# Altium schematic sheet Power_Management.SchDoc
size A4; DocumentNumber: 9; SheetNumber: 9; SheetTotal: 30
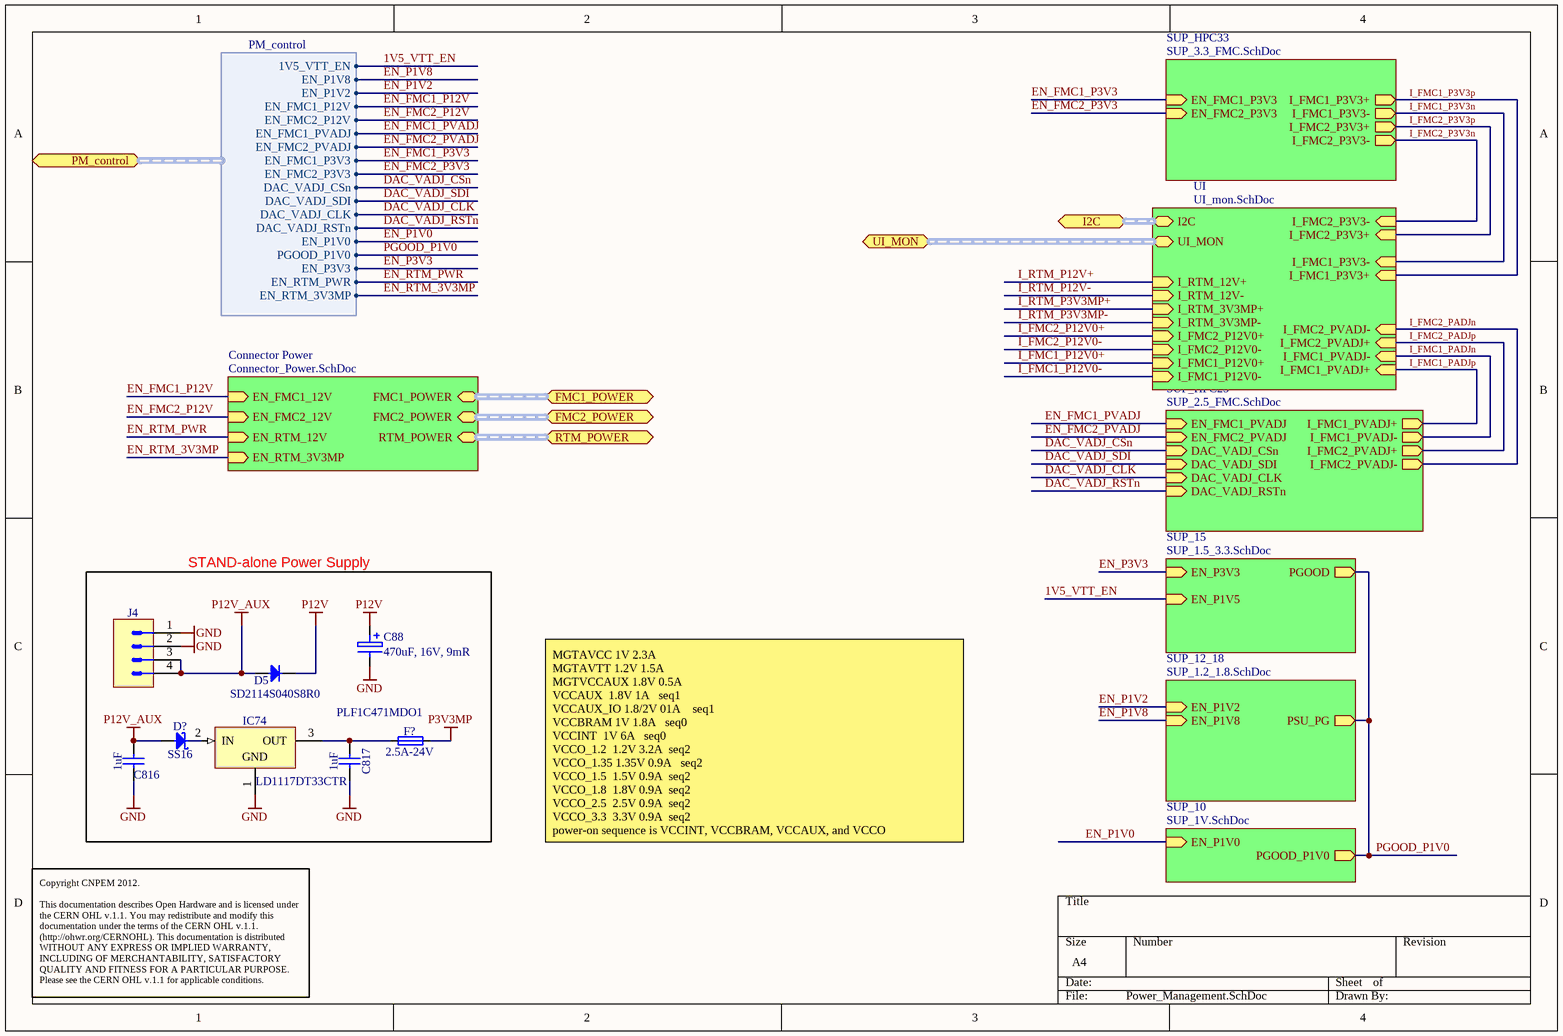
[diagram p0: Power_Management.SchDoc]

## Parts
C88  PLF1C471MDO1  value 470uF, 16V, 9mR  [CAPPR500-1000X1250]
C816  1uF  [CAPC1608X87N]
C817  1uF  [CAPC1608X87N]
D5  SD2114S040S8R0  [AVX_SMB (D0-214AA)]
D?  SS16  [DIOM5127X229N]
F?  2.5A-24V  [FUSC1608X55N]
IC74  LD1117DT33CTR  [TO228P972X240-3N-R540X510]
J4  Mini-Fit Jr.™  [MOLEX_39-28-1043]  (value not drawn)

## Blocks framed on the sheet
STAND-alone Power Supply: C88 C816 C817 D5 D? F? IC74 J4

## Sub-sheets
Connector Power = Connector_Power.SchDoc: FMC2_POWER (harness FMC_J1_POWER), EN_FMC1_12V (in), FMC1_POWER (harness FMC_J1_POWER), EN_FMC2_12V (in), EN_RTM_12V (in), RTM_POWER (harness RTM_POWER), EN_RTM_3V3MP (in)
SUP_10 = SUP_1V.SchDoc: PGOOD_P1V0 (out), EN_P1V0 (in)
SUP_12_18 = SUP_1.2_1.8.SchDoc: EN_P1V2 (in), EN_P1V8 (in), PSU_PG (out)
SUP_15 = SUP_1.5_3.3.SchDoc: PGOOD (out), EN_P1V5 (in), EN_P3V3 (in)
SUP_HPC25 = SUP_2.5_FMC.SchDoc: EN_FMC1_PVADJ (in), EN_FMC2_PVADJ (in), I_FMC1_PVADJ+ (out), I_FMC1_PVADJ- (out), I_FMC2_PVADJ+ (out), I_FMC2_PVADJ- (out), DAC_VADJ_CSn (in), DAC_VADJ_SDI (in), DAC_VADJ_CLK (in), DAC_VADJ_RSTn (in)
SUP_HPC33 = SUP_3.3_FMC.SchDoc: EN_FMC1_P3V3 (in), EN_FMC2_P3V3 (in), I_FMC1_P3V3+ (out), I_FMC1_P3V3- (out), I_FMC2_P3V3+ (out), I_FMC2_P3V3- (out)
UI = UI_mon.SchDoc: I_FMC2_P3V3- (in), I_FMC2_P3V3+ (in), I_FMC1_P3V3- (in), I_FMC1_P3V3+ (in), I_FMC1_PVADJ+ (in), I_FMC1_PVADJ- (in), I_FMC2_PVADJ+ (in), I_FMC2_PVADJ- (in), I_FMC2_P12V0+ (in), I_FMC2_P12V0- (in), I_FMC1_P12V0+ (in), I_FMC1_P12V0- (in), I2C (harness I2C), I_RTM_12V+ (in), I_RTM_12V- (in), I_RTM_3V3MP+ (in), I_RTM_3V3MP- (in), UI_MON (harness UI_MON)

## Ports
FMC1_POWER, FMC2_POWER, I2C (harness I2C), PM_control (harness PM_control), RTM_POWER, UI_MON

## Harnesses
PM_control: EN_P1V8, EN_P1V2, EN_FMC1_P12V, EN_FMC2_P12V, EN_FMC1_PVADJ, EN_FMC2_PVADJ, EN_FMC1_P3V3, EN_FMC2_P3V3, DAC_VADJ_CSn, DAC_VADJ_SDI, DAC_VADJ_CLK, DAC_VADJ_RSTn, 1V5_VTT_EN, EN_P1V0, PGOOD_P1V0, EN_P3V3, EN_RTM_PWR, EN_RTM_3V3MP

## Nets
GND: C88.2 C816.2 C817.2 IC74.1(GND) J4.1 J4.2
P3V3MP: F?.1
P12V: C88.1 D5.1(C)
P12V_AUX: C816.1 D5.2(A) D?.2(A) J4.3 J4.4
1V5_VTT_EN: sheet SUP_15/EN_P1V5, port PM_control.1V5_VTT_EN
DAC_VADJ_CLK: sheet SUP_HPC25/DAC_VADJ_CLK, port PM_control.DAC_VADJ_CLK
DAC_VADJ_CSn: sheet SUP_HPC25/DAC_VADJ_CSn, port PM_control.DAC_VADJ_CSn
DAC_VADJ_RSTn: sheet SUP_HPC25/DAC_VADJ_RSTn, port PM_control.DAC_VADJ_RSTn
DAC_VADJ_SDI: sheet SUP_HPC25/DAC_VADJ_SDI, port PM_control.DAC_VADJ_SDI
EN_FMC1_P3V3: sheet SUP_HPC33/EN_FMC1_P3V3, port PM_control.EN_FMC1_P3V3
EN_FMC1_P12V: sheet Connector Power/EN_FMC1_12V, port PM_control.EN_FMC1_P12V
EN_FMC1_PVADJ: sheet SUP_HPC25/EN_FMC1_PVADJ, port PM_control.EN_FMC1_PVADJ
EN_FMC2_P3V3: sheet SUP_HPC33/EN_FMC2_P3V3, port PM_control.EN_FMC2_P3V3
EN_FMC2_P12V: sheet Connector Power/EN_FMC2_12V, port PM_control.EN_FMC2_P12V
EN_FMC2_PVADJ: sheet SUP_HPC25/EN_FMC2_PVADJ, port PM_control.EN_FMC2_PVADJ
EN_P1V0: sheet SUP_10/EN_P1V0, port PM_control.EN_P1V0
EN_P1V2: sheet SUP_12_18/EN_P1V2, port PM_control.EN_P1V2
EN_P1V8: sheet SUP_12_18/EN_P1V8, port PM_control.EN_P1V8
EN_P3V3: sheet SUP_15/EN_P3V3, port PM_control.EN_P3V3
EN_RTM_3V3MP: sheet Connector Power/EN_RTM_3V3MP, port PM_control.EN_RTM_3V3MP
EN_RTM_PWR: sheet Connector Power/EN_RTM_12V, port PM_control.EN_RTM_PWR
I_FMC1_P3V3n: sheet SUP_HPC33/I_FMC1_P3V3-, sheet UI/I_FMC1_P3V3-
I_FMC1_P3V3p: sheet SUP_HPC33/I_FMC1_P3V3+, sheet UI/I_FMC1_P3V3+
I_FMC1_P12V0+: sheet UI/I_FMC1_P12V0+
I_FMC1_P12V0-: sheet UI/I_FMC1_P12V0-
I_FMC1_PADJn: sheet SUP_HPC25/I_FMC1_PVADJ-, sheet UI/I_FMC1_PVADJ-
I_FMC1_PADJp: sheet SUP_HPC25/I_FMC1_PVADJ+, sheet UI/I_FMC1_PVADJ+
I_FMC2_P3V3n: sheet SUP_HPC33/I_FMC2_P3V3-, sheet UI/I_FMC2_P3V3-
I_FMC2_P3V3p: sheet SUP_HPC33/I_FMC2_P3V3+, sheet UI/I_FMC2_P3V3+
I_FMC2_P12V0+: sheet UI/I_FMC2_P12V0+
I_FMC2_P12V0-: sheet UI/I_FMC2_P12V0-
I_FMC2_PADJn: sheet SUP_HPC25/I_FMC2_PVADJ-, sheet UI/I_FMC2_PVADJ-
I_FMC2_PADJp: sheet SUP_HPC25/I_FMC2_PVADJ+, sheet UI/I_FMC2_PVADJ+
I_RTM_P3V3MP+: sheet UI/I_RTM_3V3MP+
I_RTM_P3V3MP-: sheet UI/I_RTM_3V3MP-
I_RTM_P12V+: sheet UI/I_RTM_12V+
I_RTM_P12V-: sheet UI/I_RTM_12V-
PGOOD_P1V0: sheet SUP_15/PGOOD, sheet SUP_12_18/PSU_PG, sheet SUP_10/PGOOD_P1V0, port PM_control.PGOOD_P1V0
NetC817_1: C817.1 F?.2 IC74.3(OUT)
NetD?_1: D?.1(C) IC74.2(IN)

## Buses and harness runs
harness port FMC1_POWER = sheet Connector Power/FMC1_POWER
harness port FMC2_POWER = sheet Connector Power/FMC2_POWER
harness port I2C = sheet UI/I2C
harness port RTM_POWER = sheet Connector Power/RTM_POWER
harness port UI_MON = sheet UI/UI_MON

## Notes on the sheet
- MGTAVCC	1V	2.3A
  MGTAVTT	1.2V	1.5A
  MGTVCCAUX	1.8V	0.5A
  VCCAUX		1.8V	1A			seq1
  VCCAUX_IO	1.8/2V	01A 			seq1
  VCCBRAM	1V	1.8A			seq0
  VCCINT		1V	6A			seq0
  VCCO_1.2		1.2V	3.2A		seq2
  VCCO_1.35	1.35V	0.9A			seq2
  VCCO_1.5		1.5V	0.9A		seq2
  VCCO_1.8		1.8V	0.9A		seq2
  VCCO_2.5		2.5V	0.9A		seq2
  VCCO_3.3		3.3V	0.9A		seq2
  power-on sequence is VCCINT, VCCBRAM, VCCAUX, and VCCO
  voltage difference between VCCO and VCCAUX must not exceed 2.625V for longer than TVCCO2VCCAUX
  power-on sequence to achieve minimum current draw for the GTP transceivers is VCCINT, VMGTAVCC,
  VMGTAVTT OR VMGTAVCC, VCCINT, VMGTAVTT. There is no recommended sequencing for VMGTVCCAUX. Both VMGTAVCC and
  VCCINT can be ramped simultaneously. The recommended power-off sequence is the reverse of the power-on sequence to
  achieve minimum current draw.
  When VMGTAVTT is powered before VMGTAVCC and VMGTAVTT – VMGTAVCC > 150 mV and VMGTAVCC < 0.7V, the
  VMGTAVTT current draw can increase by 460 mA per transceiver during VMGTAVCC ramp up. The duration of the current
  draw can be up to 0.3 x TMGTAVCC (ramp time from GND to 90% of VMGTAVCC). The reverse is true for power-down.
  • When VMGTAVTT is powered before VCCINT and VMGTAVTT – VCCINT > 150 mV and VCCINT < 0.7V, the VMGTAVTT current
  draw can increase by 50 mA per transceiver during VCCINT ramp up. The duration of the current draw can be up to
  0.3 x TVCCINT (ramp time from GND to 90% of VCCINT). The reverse is true for power-down.
- Copyright CNPEM 2012.
  This documentation describes Open Hardware and is licensed under the CERN OHL v.1.1. You may redistribute and modify this documentation under the terms of the CERN OHL v.1.1. (http://ohwr.org/CERNOHL). This documentation is distributed WITHOUT ANY EXPRESS OR IMPLIED WARRANTY, INCLUDING OF MERCHANTABILITY, SATISFACTORY QUALITY AND FITNESS FOR A PARTICULAR PURPOSE. Please see the CERN OHL v.1.1 for applicable conditions.

## Library data of the parts
C88 = CAP_POLYMER_10mm: POLY, 470uF, 16V, ESR: 9mR
C816 C817 = CC0603_1UF_16V_10%_X7R: Non-polarised capacitor; Part Description: SMD Multilayer Chip Ceramic Capacitor; Manufacturer: GENERIC; Manufacturer1 Part Number: 223824613663; Voltage: 16V; TC: X7R; Tolerance: ±10%; Table: Capacitors SMD; Part Number: CC0603_1UF_16V_10%_X7R; Component Kind: Standard; Component Type: Standard; Pin Count: 2; Value: 1uF; Status: Preferred; Manufacturer Part Number: CC0603_1uF_16V_10%_X7R; Case: 0603; Mounted: Yes; Socket: No; SMD: Yes; Manufacturer1 Example: PHYCOMP; Manufacturer1 ComponentHeight: 0.87mm; HelpURL: \\cern.ch\dfs\Applications\Altium\Datasheets\CC0805_X5R_PHYCOMP_HC.pdf; Author: CERN DEM JLC; CreateDate: 2007-12-03; LatestRevisionDate: 2007-12-03
D5 = SD2114S040S8R0: Diode; Part Description: Schottky Barrier Rectifier Diode; Manufacturer: AVX; Voltage: 40V; Power: 8A; PressFit: No; Bonding: No; Part Number: SD2114S040S8R0; Component Kind: Standard; Component Type: Standard; Device: SD2114S040S8R0; PackageDescription: AVX SMB DO-214-AA Lead-less Chip Form, 2-Leads, Body 5.2x3.6mm; Manufacturer Part Number: SD2114S040S8R0; Pin Count: 2; Case: D0-214AA; Mounted: Yes; Socket: No; SMD: Yes; Sense: No; ComponentHeight: 1.2mm; HelpURL: \\cern.ch\dfs\Applications\Altium\Datasheets\SD2114S040S8R0.pdf; Author: CERN DEM JLC; CreateDate: 20/10/2016; LatestRevisionDate: 20/10/2016
D? = SS16: Schottky Diode; Part Description: Surface Mount Schottky Barrier Rectifier; Manufacturer: VISHAY GENERAL SEMICONDUCTOR; Voltage: 60V; Power: 1A; Table: Diodes; Part Number: SS16; Component Kind: Standard; Component Type: Standard; Device: SS16; PackageDescription: DO-214-AC Molded Diode, Body 5.1x2.7mm, IPC Medium Density; Manufacturer Part Number: SS16; Pin Count: 2; Case: DO-214AC; Mounted: Yes; Socket: No; SMD: Yes; ComponentHeight: 2.29mm; HelpURL: \\cern.ch\dfs\Applications\Altium\Datasheets\SS16.pdf; Author: CERN DEM JLC; CreateDate: 2008-07-15; LatestRevisionDate: 2010-08-23
F? = FUS0603_BOURNS-SF-0603F250-2: Fuse; Part Description: Thin Film Chip Fuse; Manufacturer: BOURNS; PressFit: No; Part Number: FUS0603_BOURNS-SF-0603F250-2; Component Kind: Standard; Component Type: Standard; Pin Count: 2; PackageDescription: Chip Fuse, 2-Leads, Body 1.6mm x 0.8mm, IPC Medium Density; Family: Fuse; Mounted: Yes; Socket: No; SMD: Yes; Sense: No; Value: 2.5A-24V; Manufacturer Part Number: SF-0603F250-2; ComponentHeight: 0.55mm; HelpURL: \\cern.ch\dfs\Applications\Altium\Datasheets\FUSE_BOURNS_SF-0603F.pdf; Author: CERN DEM JLC; CreateDate: 31/03/2010; LatestRevisionDate: 31/03/2010
IC74 = LD1117DT33CTR: 3-Terminal Regulator 1=GND 2=IN 3=OUT; Part Description: 3.3V 800mA Low drop fixed and adjustable positive voltage regulators; Manufacturer: ST MICROELECTRONICS; Table: Regulators; Part Number: LD1117DT33CTR; Component Kind: Standard; Component Type: Standard; Device: LD1117DT33CTR; PackageDescription: DPAK TO-252, 2.28mm pitch; 2 pin, 9.725mm L X 6.10mm W X 2.40mm H body, IPC Medium Density; Manufacturer Part Number: LD1117DT33CTR; Pin Count: 3; Case: DPAK; Mounted: Yes; Socket: No; SMD: Yes; ComponentHeight: 2.4mm; HelpURL: \\cern.ch\dfs\Applications\Altium\Datasheets\LD1117DT33CTR.pdf; Author: CERN DEM JLC; CreateDate: 2011-06-08; LatestRevisionDate: 2011-06-08
J4 = MOLEX_39-28-1043: Connector 4 Male; Part Description: 4.20mm (.165") Pitch Mini-Fit Jr.™ Header, Dual Row, Vertical, without Snap-in Plastic Peg PCB Lock, 4 Circuits; Manufacturer: MOLEX; Part Number: MOLEX_39-28-1043; Component Kind: Standard; Component Type: Standard; Pin Count: 4; Family: Mini-Fit Jr.™; Mounted: Yes; Socket: No; SMD: No; Status: None; Manufacturer Part Number: 39-28-1043; ComponentHeight: 13.1mm; HelpURL: \\cern.ch\dfs\Applications\Altium\Datasheets\MOLEX_39-28-1043.pdf; Author: CERN DEM JLC; CreateDate: 2009-03-12; LatestRevisionDate: 2012-03-06; Table: MOLEX